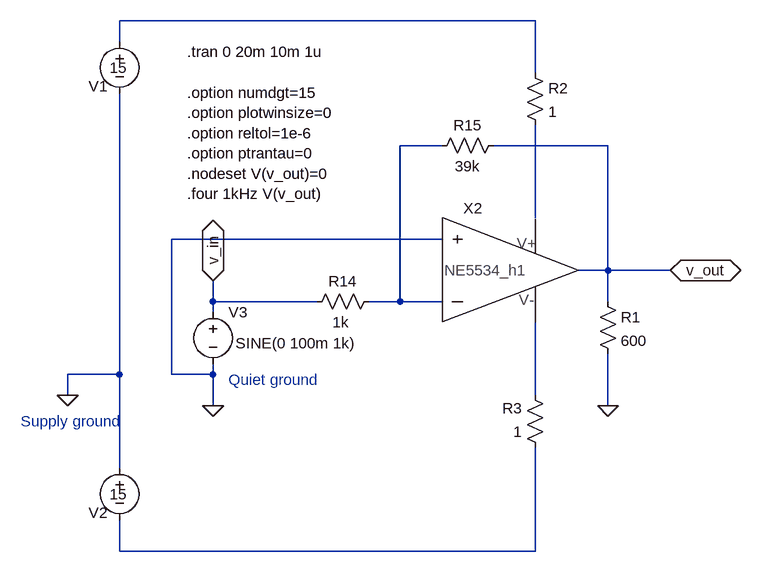
[diagram p0: schematic NE5534_h1 (x-40 4.60ppm 600ohm).asc]
NE5534_h1 (x-40 4.60ppm 600ohm).asc, the LTspice schematic file:
Version 4
SHEET 1 880 1160
WIRE -4144 -432 -4784 -432
WIRE -4784 -400 -4784 -432
WIRE -4144 -352 -4144 -432
WIRE -4288 -240 -4352 -240
WIRE -4032 -240 -4208 -240
WIRE -4144 -128 -4144 -272
WIRE -4288 -96 -4704 -96
WIRE -4032 -48 -4032 -240
WIRE -4032 -48 -4080 -48
WIRE -3936 -48 -4032 -48
WIRE -4640 0 -4640 -32
WIRE -4480 0 -4640 0
WIRE -4352 0 -4352 -240
WIRE -4352 0 -4400 0
WIRE -4288 0 -4352 0
WIRE -4032 0 -4032 -48
WIRE -4640 16 -4640 0
WIRE -4784 112 -4784 -320
WIRE -4784 112 -4864 112
WIRE -4704 112 -4704 -96
WIRE -4640 112 -4640 96
WIRE -4640 112 -4704 112
WIRE -4864 144 -4864 112
WIRE -4144 144 -4144 32
WIRE -4640 160 -4640 112
WIRE -4032 160 -4032 80
WIRE -4784 256 -4784 112
WIRE -4784 384 -4784 336
WIRE -4144 384 -4144 224
WIRE -4144 384 -4784 384
FLAG -4640 160 0
FLAG -4864 144 0
FLAG -3936 -48 v_out
IOPIN -3936 -48 BiDir
FLAG -4640 -32 v_in
IOPIN -4640 -32 BiDir
FLAG -4032 160 0
SYMBOL voltage -4640 0 R0
WINDOW 39 0 0 Left 0
WINDOW 3 35 64 Left 0
SYMATTR Value SINE(0 100m 1k)
SYMATTR Value2 AC 1
SYMATTR InstName V3
SYMBOL res -4384 -16 R90
WINDOW 0 0 56 VBottom 0
WINDOW 3 32 59 VTop 0
SYMATTR InstName R14
SYMATTR Value 1k
SYMBOL res -4192 -256 R90
WINDOW 0 0 56 VBottom 0
WINDOW 3 32 56 VTop 0
SYMATTR InstName R15
SYMATTR Value 39k
SYMBOL voltage -4784 -416 M0
WINDOW 0 18 85 Left 0
WINDOW 3 -12 56 Left 0
WINDOW 123 0 0 Left 0
WINDOW 39 0 0 Left 0
SYMATTR InstName V1
SYMATTR Value 15
SYMBOL voltage -4784 240 M0
WINDOW 0 18 85 Left 0
WINDOW 3 -12 56 Left 0
WINDOW 123 0 0 Left 0
WINDOW 39 0 0 Left 0
SYMATTR InstName V2
SYMATTR Value 15
SYMBOL res -4048 -16 R0
SYMATTR InstName R1
SYMATTR Value 600
SYMBOL res -4160 -368 R0
SYMATTR InstName R2
SYMATTR Value 1
SYMBOL res -4128 240 R180
WINDOW 0 36 76 Left 0
WINDOW 3 36 40 Left 0
SYMATTR InstName R3
SYMATTR Value 1
SYMBOL NE5534_h1 -4192 -48 R0
SYMATTR InstName X2
TEXT -4680 -384 Left 0 !.tran 0 20m 10m 1u\n \n.option numdgt=15\n.option plotwinsize=0\n.option reltol=1e-6\n.option ptrantau=0\n.nodeset V(v_out)=0\n.four 1kHz V(v_out)
TEXT -4616 120 Left 0 ;Quiet ground
TEXT -4936 184 Left 0 ;Supply ground

The netlist it stands for:
* NE5534_h1 (x-40 4.60ppm 600ohm).asc
V3 v_in 0 SINE(0 100m 1k) AC 1
R14 N002 v_in 1k
R15 v_out N002 39k
V1 N001 0 15
V2 0 N005 15
R1 v_out 0 600
R2 N001 N003 1
R3 N005 N004 1
XX2 0 N003 v_out N004 N002 NE5534_h1  ; pins +in V+ out V- -in
.tran 0 20m 10m 1u
.option numdgt=15
.option plotwinsize=0
.option reltol=1e-6
.option ptrantau=0
.nodeset V(v_out)=0
.four 1kHz V(v_out)
* Quiet ground
* Supply ground
.backanno
.end